# EAGLE design FFT-spectrum-analyser (EAGLE 9.6.2)
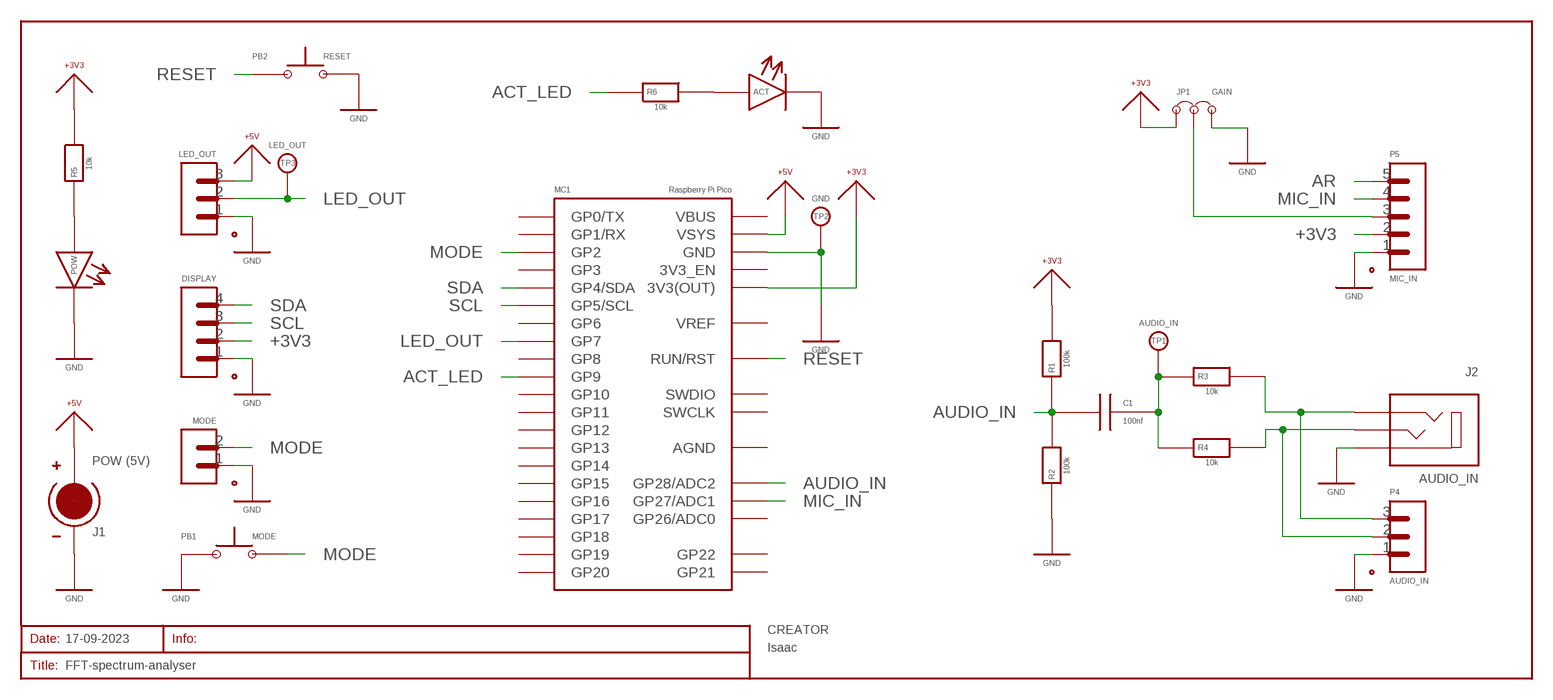
[diagram p0: schematic, sheet 1]

## Parts
ACT  LED_3MM  [LED_3MM]
C1  100nf  CAPACITOR_UNPOLARISED_5.08MM  [CAPACITOR_UNPOLARISED_5.08MM]
CREATOR  Isaac  INFO_T  [INFO_T]
DISPLAY  PORT_4-PIN_HEADER  [HEADER_4-PIN]
J1  POW (5V)  DC_POWER_CENTER-POS_XH2.54  [XH2.54_2-PIN]
J2  AUDIO_IN  3.5MM-JACK_TYPE-A  [3.5MM-JACK]
JP1  GAIN  JUMPER_3-WAY_HEADER  [HEADER_3-PIN_JUMPER]
LED_OUT  PORT_3-PIN_XH2.54  [XH2.54_3-PIN]
MC1  RASPBERRY-PI-PICO_THT  [RASPBERRY-PI-PICO_THT]
MODE  PORT_2-PIN_XH2.54  [XH2.54_2-PIN]
P4  AUDIO_IN  PORT_3-PIN_XH2.54  [XH2.54_3-PIN]
P5  MIC_IN  PORT_5-PIN_XH2.54  [XH2.54_5-PIN]
PB1  MODE  MOMENTARY-SWITCH_NO_PUSHBUTTON  [6MM_PUSHBUTTON]
PB2  RESET  MOMENTARY-SWITCH_NO_PUSHBUTTON  [6MM_PUSHBUTTON]
POW  LED_3MM  [LED_3MM]
R1  100k  RESISTOR  [RESISTOR_10.16MM]
R2  100k  RESISTOR  [RESISTOR_10.16MM]
R3  10k  RESISTOR  [RESISTOR_10.16MM]
R4  10k  RESISTOR  [RESISTOR_10.16MM]
R5  10k  RESISTOR  [RESISTOR_10.16MM]
R6  10k  RESISTOR  [RESISTOR_10.16MM]
SCHEMATIC1  17-09-2023  SHEET  [SHEET]
TP1  AUDIO_IN  TEST-POINT_T  [PAD_T]
TP2  GND  TEST-POINT_T  [PAD_T]
TP3  LED_OUT  TEST-POINT_T  [PAD_T]

## Nets
+3V3: DISPLAY.2 JP1.1 MC1.36(3V3(OUT)) P5.2 R1.2 R5.2
+5V: J1.2(+) LED_OUT.3 MC1.39(VSYS)
ACT_LED: MC1.12(GP9) R6.1
AR: P5.5
AUDIO_IN: C1.1 MC1.34(GP28/ADC2) R1.1 R2.2
GAIN: JP1.A P5.3
GND: ACT.- DISPLAY.1 J1.1(GND) J2.SLEEVE JP1.2 LED_OUT.1 MC1.3(GND) MC1.8(GND) MC1.13(GND) MC1.18(GND) MC1.23(GND) MC1.28(GND) MC1.38(GND) MC1.D_GND(GND) MODE.1 P4.1 P5.1 PB1.1_A PB1.1_B PB2.2_A PB2.2_B POW.- R2.1 TP2.1
LED_OUT: LED_OUT.2 MC1.10(GP7) TP3.1
MIC_IN: MC1.32(GP27/ADC1) P5.4
MODE: MC1.4(GP2) MODE.2 PB1.2_A PB1.2_B
N$3: POW.+ R5.1
N$4: ACT.+ R6.2
N$9: J2.TIP_A(TIP_L) J2.TIP_B(TIP_L) P4.2 R4.2
N$10: J2.RING_A(RING_R) J2.RING_B(RING_R) P4.3 R3.2
N$11: C1.2 R3.1 R4.1 TP1.1
RESET: MC1.30(RUN/RST) PB2.1_A PB2.1_B
SCL: DISPLAY.3 MC1.7(GP5/SCL)
SDA: DISPLAY.4 MC1.6(GP4/SDA)
Unconnected: MC1.1(GP0/TX) MC1.2(GP1/RX) MC1.5(GP3) MC1.9(GP6) MC1.11(GP8) MC1.14(GP10) MC1.15(GP11) MC1.16(GP12) MC1.17(GP13) MC1.19(GP14) MC1.20(GP15) MC1.21(GP16) MC1.22(GP17) MC1.24(GP18) MC1.25(GP19) MC1.26(GP20) MC1.27(GP21) MC1.29(GP22) MC1.31(GP26/ADC0) MC1.35(VREF) MC1.37(3V3_EN) MC1.40(VBUS) MC1.SWCLK MC1.SWDIO

## Power pins joined to a net without a drawn wire
AGND: MC1.33(AGND)

## Library data of the parts
ACT POW = myLibrary:LED
C1 = myLibrary:CAPACITOR_UNPOLARISED
CREATOR = myLibrary:INFO
DISPLAY = myLibrary:PORT_4-PIN
J1 = myLibrary:DC_POWER_CENTER-POS
J2 = myLibrary:3.5MM-JACK
JP1 = myLibrary:JUMPER_3-WAY
LED_OUT P4 = myLibrary:PORT_3-PIN
MC1 = myLibrary:RASPBERRY-PI-PICO
MODE = myLibrary:PORT_2-PIN
P5 = myLibrary:PORT_5-PIN
PB1 PB2 = myLibrary:MOMENTARY-SWITCH_NO
R1-R6 = myLibrary:RESISTOR
SCHEMATIC1 = myLibrary:SHEET
TP1-TP3 = myLibrary:TEST-POINT

## Board
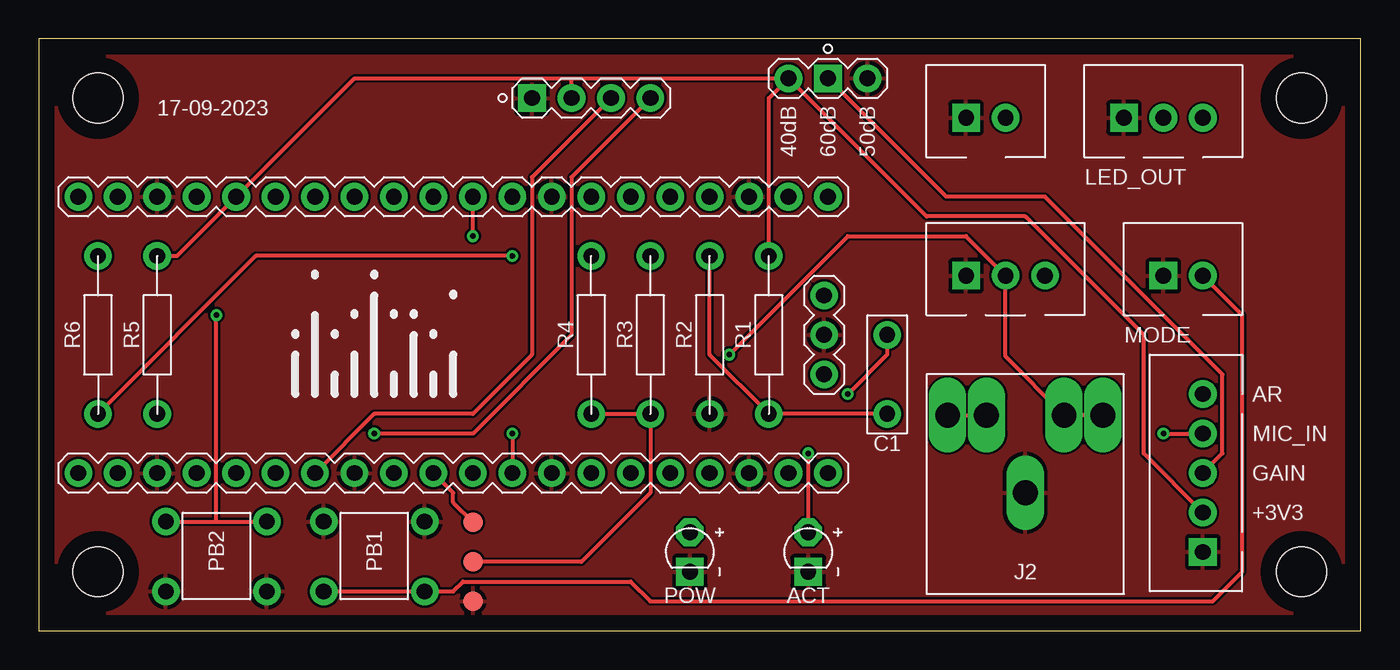
[diagram p1: board, top side]
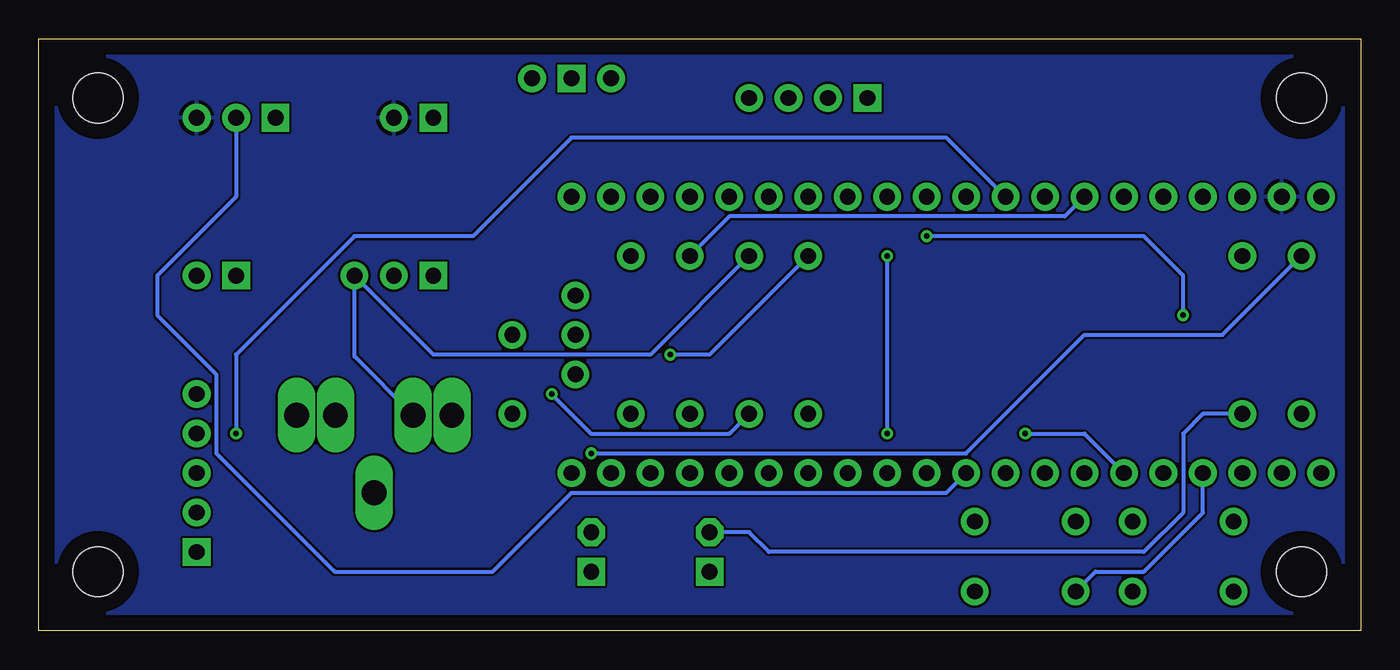
[diagram p2: board, bottom side, seen from below]

Size 85.09 x 38.1 mm. Coordinates in mm from the lower left corner, seen from the top.
Outline: 0,0 85.09,0 85.09,38.1 0,38.1 0,0
Copper layers (1*16): Top 0.035mm / dielectric 1.5mm / Bottom 0.035mm
Design rules "default": minimum track width 6mil, minimum drill 0.35mm, track to track 6mil, track to pad 6mil, pad to pad 6mil, via to via 6mil, smd to smd 6mil, copper to edge 40mil, drill to drill 6mil, minimum pad ring 10mil, minimum via ring 8mil, stop-mask expansion 4mil, vias tented up to drill 0mil, thermal gap 10mil
Holes 3.2 mm at 3.81,3.81 3.81,34.29 81.28,34.29 81.28,3.81

### Footprints (pad centres in the part's own frame; a part is rotated, then mirrored left to right if it is on the bottom)
LED_3MM = drill 1.016 pad 1.778 octagon: + -1.27,0 | drill 1.016 pad 1.778 square: - 1.27,0
CAPACITOR_UNPOLARISED_5.08MM = drill 1.016 pad 1.778: 1 -2.54,0; 2 2.54,0
HEADER_4-PIN = drill 1.016 pad 1.778 square: 1 0,0 | drill 1.016 pad 1.778: 2 0,2.54; 3 0,5.08; 4 0,7.62
XH2.54_2-PIN = drill 1.016 pad 1.778 square: 1 -1.27,0 | drill 1.016 pad 1.778: 2 1.27,0
3.5MM-JACK = drill 1.6 pad 2.286 long: RING_A -5,5; RING_B -2.5,5; SLEEVE 0,0; TIP_A 2.5,5; TIP_B 5,5
HEADER_3-PIN_JUMPER = drill 1.016 pad 1.778: 1 0,0; 2 0,5.08 | drill 1.016 pad 1.778 square: A 0,2.54
XH2.54_3-PIN = drill 1.016 pad 1.778 square: 1 -2.54,0 | drill 1.016 pad 1.778: 2 0,0; 3 2.54,0
RASPBERRY-PI-PICO_THT = drill 1.016 pad 1.778: 1 -8.89,24.13; 2 -8.89,21.59; 3 -8.89,19.05; 4 -8.89,16.51; 5 -8.89,13.97; 6 -8.89,11.43; 7 -8.89,8.89; 8 -8.89,6.35; 9 -8.89,3.81; 10 -8.89,1.27; 11 -8.89,-1.27; 12 -8.89,-3.81; 13 -8.89,-6.35; 14 -8.89,-8.89; 15 -8.89,-11.43; 16 -8.89,-13.97; 17 -8.89,-16.51; 18 -8.89,-19.05; 19 -8.89,-21.59; 20 -8.89,-24.13; 21 8.89,-24.13; 22 8.89,-21.59; 23 8.89,-19.05; 24 8.89,-16.51; 25 8.89,-13.97; 26 8.89,-11.43; 27 8.89,-8.89; 28 8.89,-6.35; 29 8.89,-3.81; 30 8.89,-1.27; 31 8.89,1.27; 32 8.89,3.81; 33 8.89,6.35; 34 8.89,8.89; 35 8.89,11.43; 36 8.89,13.97; 37 8.89,16.51; 38 8.89,19.05; 39 8.89,21.59; 40 8.89,24.13; D_GND 0,-23.876; SWCLK -2.54,-23.876; SWDIO 2.54,-23.876
XH2.54_5-PIN = drill 1.016 pad 1.778 square: 1 -5.08,0 | drill 1.016 pad 1.778: 2 -2.54,0; 3 0,0; 4 2.54,0; 5 5.08,0
6MM_PUSHBUTTON = drill 1.016 pad 1.778: 1_A -3.251,4.5; 1_B 3.249,4.5; 2_A -3.251,0; 2_B 3.249,0
RESISTOR_10.16MM = drill 1.016 pad 1.778: 1 -5.08,0; 2 5.08,0
PAD_T = smd 1.27 x 1.27: 1 0,0

### Placement (x,y rotation side)
ACT  49.53,5.08 270 top
C1  54.61,16.51 90 top
CREATOR  6.35,31.11 0 top
DISPLAY  31.75,34.29 270 top
J1  60.96,33.02 0 top
J2  63.5,8.89 0 top
JP1  48.26,35.56 270 top
LED_OUT  72.39,33.02 0 top
MC1  26.67,19.05 90 top
MODE  73.66,22.86 0 top
P4  62.23,22.86 0 top
P5  74.93,10.16 90 top
PB1  21.59,2.54 0 top
PB2  11.43,2.54 0 top
POW  41.91,5.08 270 top
R1  46.99,19.05 90 top
R2  43.18,19.05 90 top
R3  39.37,19.05 90 top
R4  35.56,19.05 90 top
R5  7.62,19.05 90 top
R6  3.81,19.05 90 top
SCHEMATIC1  7.62,34.92 0 top
TP1  27.94,4.45 0 top
TP2  27.94,1.91 0 top
TP3  27.94,6.99 0 top

### Tracks (layer width: path | path; a pad name or v marks a point on that pad's centre or on a via)
+3V3
  Top 0.254: R1.2 46.99,34.29 JP1.1 | R5.2 8.89,24.13 MC1.36 20.32,35.56 34.29,35.56 | 34.29,35.56 JP1.1 | DISPLAY.2 34.29,35.56 | P5.2 71.12,11.43 71.12,19.05 63.5,26.67 57.15,26.67 JP1.1
+5V
  pour Bottom: -1.27,39.37 -1.27,-1.27 86.36,-1.27 86.36,39.37
ACT_LED  (via drill 0.35)
  Top 0.254: R6.1 13.97,24.13 v30.48,24.13 | v30.48,12.7 MC1.12
  Bottom 0.254: v30.48,24.13 v30.48,12.7
AUDIO_IN
  Top 0.254: R2.2 43.18,17.78 R1.1 C1.1
  Bottom 0.254: MC1.34 19.05,26.67 40.64,26.67 R2.2
GAIN
  Top 0.254: P5.3 76.2,11.43 76.2,16.51 64.77,27.94 58.42,27.94 JP1.A
GND
  pour Top: -2.54,40.64 -2.54,-2.54 87.63,-2.54 87.63,40.64
LED_OUT
  Top 0.254: MC1.10 26.67,8.89 26.67,8.26 TP3.1
  Bottom 0.254: LED_OUT.2 72.39,27.94 77.47,22.86 77.47,20.32 73.66,16.51 73.66,11.43 66.04,3.81 55.88,3.81 50.8,8.89 26.67,8.89 MC1.10
MIC_IN  (via drill 0.35)
  Top 0.254: v72.39,12.7 P5.4
  Bottom 0.254: MC1.32 26.67,31.75 50.8,31.75 57.15,25.4 64.77,25.4 72.39,17.78 v72.39,12.7
MODE
  Top 0.254: PB1.2_A PB1.2_B 26.67,2.54 27.3,3.17 38.1,3.17 39.37,1.91 75.56,1.91 77.47,3.81 77.47,20.32 MODE.2
  Bottom 0.254: PB1.2_A 17.07,3.81 13.97,3.81 10.16,7.62 MC1.4
N$3
  Bottom 0.254: R5.1 10.16,13.97 11.43,12.7 11.43,7.62 13.97,5.08 38.1,5.08 39.37,6.35 POW.+
N$4  (via drill 0.35)
  Top 0.254: ACT.+ v49.53,11.43
  Bottom 0.254: v49.53,11.43 25.4,11.43 17.78,19.05 8.89,19.05 R6.2
N$9  (via drill 0.35)
  Top 0.254: J2.TIP_B J2.TIP_A 62.23,17.66 P4.2 59.69,25.4 52.07,25.4 v44.45,17.78
  Bottom 0.254: R4.2 41.91,17.78 v44.45,17.78
N$10
  Top 0.254: J2.RING_A J2.RING_B
  Bottom 0.254: J2.RING_B 64.77,17.66 P4.3 59.69,17.78 45.72,17.78 R3.2
N$11  (via drill 0.35)
  Top 0.254: R4.1 R3.1 39.37,8.89 34.92,4.45 TP1.1 | C1.2 54.61,17.78 v52.07,15.24
  Bottom 0.254: v52.07,15.24 49.53,12.7 40.64,12.7 R3.1
RESET  (via drill 0.35)
  Top 0.254: PB2.1_A 11.43,7.04 | 11.43,7.04 PB2.1_B | 11.43,7.04 v11.43,20.32 | v27.94,25.4 MC1.30
  Bottom 0.254: v11.43,20.32 11.43,22.86 13.97,25.4 v27.94,25.4
SCL
  Top 0.254: DISPLAY.3 31.75,29.21 31.75,17.78 27.94,13.97 21.59,13.97 MC1.7
SDA  (via drill 0.35)
  Top 0.254: DISPLAY.4 34.29,29.21 34.29,19.05 27.94,12.7 v21.59,12.7
  Bottom 0.254: v21.59,12.7 17.78,12.7 MC1.6

### Text on the board
tPlace: 40dB | 60dB | 50dB | AR | MIC_IN | GAIN | +3V3